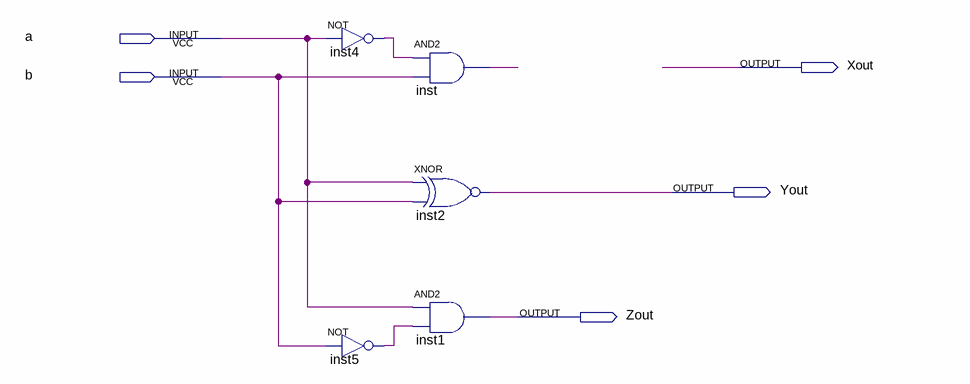
[diagram p0: schematic sheet]
// Quartus schematic Cmp1bit.bdf as structural Verilog: 5 symbols, 5 pins
module Cmp1bit (
  input  a,
  input  b,
  output Xout,
  output Yout,
  output Zout
);

  wire inst4_out, inst5_out, inst_out;

  not inst4 (inst4_out, a);
  not inst5 (inst5_out, b);
  and inst (inst_out, inst4_out, b);
  xnor inst2 (Yout, a, b);
  and inst1 (Zout, a, inst5_out);
endmodule
